# EAGLE design xboxeeprombeforearoute-2 (EAGLE 7.5.0)
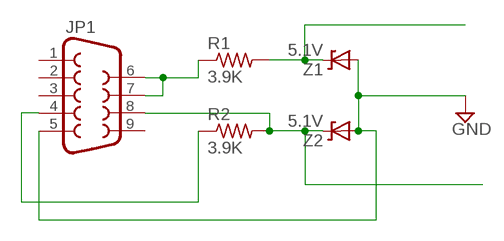
[diagram p0: schematic, sheet 1]

## Parts
JP1  DB9FEMALE  [DB9]
R1  3.9K  R-US_0207/9  [0207/9]
R2  3.9K  R-US_0207/9  [0207/9]
Z1  5.1V  DIODE-ZENERPTH  [DIODE-ZENER]
Z2  5.1V  DIODE-ZENERPTH  [DIODE-ZENER]

## Nets
GND: JP1.5 Z1.P$2(A) Z2.P$2(A)
N$1: JP1.6 JP1.7 R1.1
N$3: JP1.4 R2.1
SCL: R1.2 Z1.P$1(C)
SDA: JP1.8 R2.2 Z2.P$1(C)
Unconnected: JP1.1 JP1.2 JP1.3 JP1.9

## Library data of the parts
JP1 = SparkFun-Connectors:DB9: DB9 Connector Standard DB9 (D-Sub 9) serial connector. Can be used for CAN bus as well as RS485 and RS232. Footprint production proven. Spark Fun Electronics SKU : PRT-00429; OC_NEWARK: unknown; PROD_ID: CONN-08194
R1 R2 = adafruit:R-US_: RESISTOR, American symbol; OC_NEWARK: unknown
Z1 Z2 = Johnboiles:DIODE-ZENER: Zener Diode Production Part - 8199 3.4V Zener Voltage; OC_NEWARK: unknown

## Board
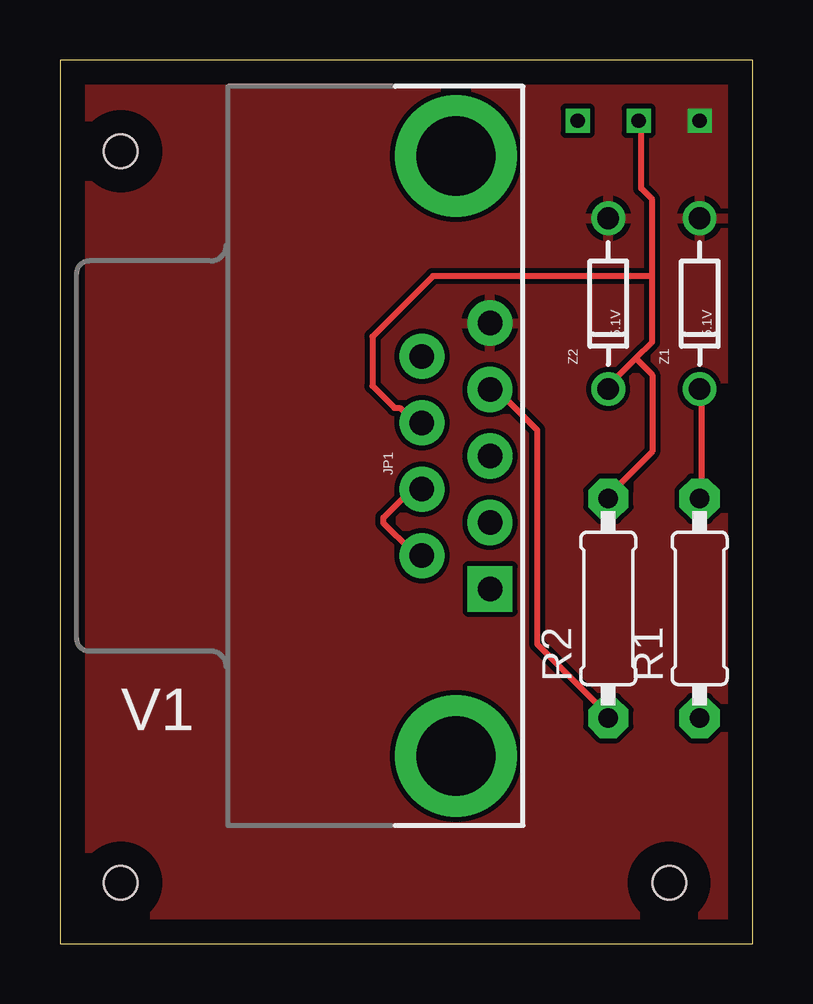
[diagram p1: board, top side]
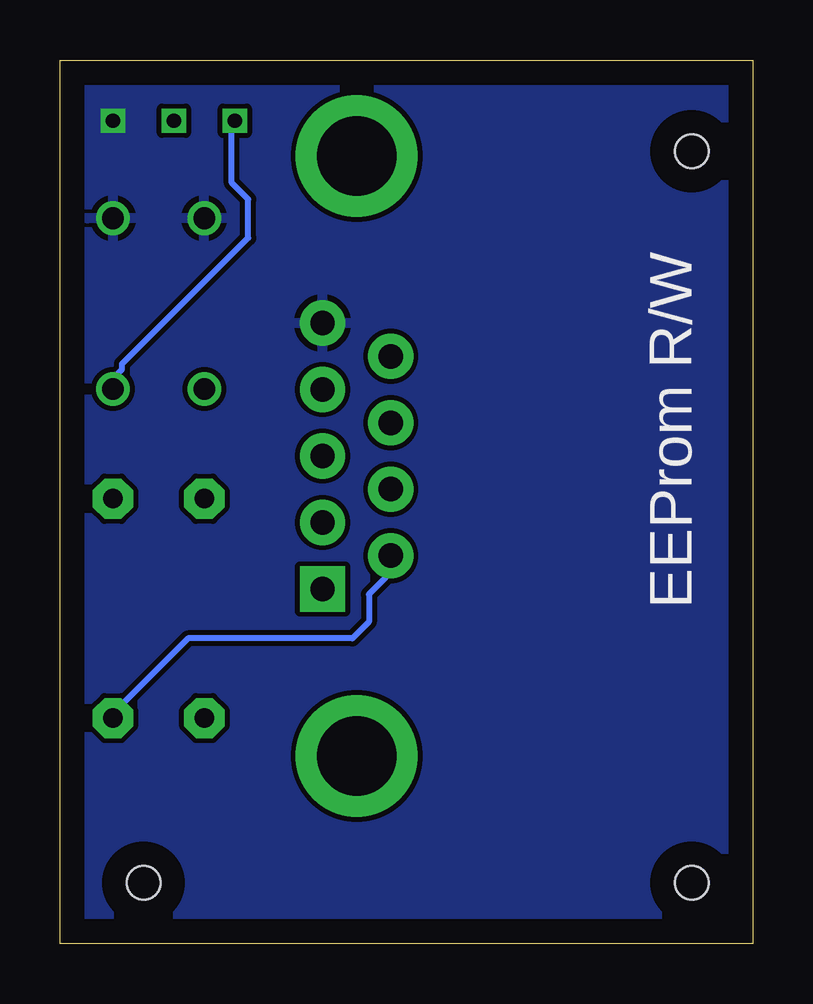
[diagram p2: board, bottom side, seen from below]

Size 28.88 x 36.82 mm. Coordinates in mm from the lower left corner, seen from the top.
Outline: 0,0 28.88,0 28.88,36.82 0,36.82 0,0
Copper layers (1*16): Top 0.035mm / dielectric 1.5mm / Bottom 0.035mm
Design rules "default": minimum track width 10mil, minimum drill 24mil, track to track 8mil, track to pad 8mil, pad to pad 8mil, via to via 8mil, smd to smd 8mil, copper to edge 40mil, drill to drill 8mil, minimum pad ring 10mil, minimum via ring 8mil, stop-mask expansion 4mil, vias tented up to drill 0mil, thermal gap 10mil
Holes 1.4 mm at 2.54,33.02 2.54,2.54 25.4,2.54

### Footprints (pad centres in the part's own frame; a part is rotated, then mirrored left to right if it is on the bottom)
DB9 = drill 1.016 pad 1.88 square: 1 -5.54,-1.42 | drill 1.016 pad 1.88: 2 -2.77,-1.42; 3 0,-1.42; 4 2.77,-1.42; 5 5.54,-1.42; 6 -4.15,1.42; 7 -1.38,1.42; 8 1.38,1.42; 9 4.15,1.42 | drill 3.302 pad 5.08: G1 -12.5,0; G2 12.5,0
0207/9 = drill 0.813 pad 1.676 octagon: 1 -4.572,0; 2 4.572,0
DIODE-ZENER = drill 0.9: P$1 -3.556,0; P$2 3.556,0

### Placement (x,y rotation side)
JP1  16.51,20.32 90 top
R1  26.67,13.97 90 top
R2  22.86,13.97 90 top
Z1  26.67,26.67 90 top
Z2  22.86,26.67 90 top

### Tracks (layer width: path | path; a pad name or v marks a point on that pad's centre or on a via)
GND  (via drill 0.6)
  other vias: 26.67,34.29
  pour Top: -1.27,38.1 -1.27,-2.54 30.48,-2.54 30.48,38.1
  pour Bottom: -1.27,38.1 -1.27,-1.27 31.75,-1.27 31.75,38.1
N$1
  Top 0.254: JP1.7 15.09,18.9 14.63,18.9 13.49,17.75 13.49,17.53 14.63,16.38 15.09,16.38 JP1.6
  Bottom 0.254: R1.1 26.52,9.52 26.52,9.75 23.55,12.72 16.69,12.72 16,13.41 16,14.55 15.32,15.24 15.32,16.15 JP1.6
N$3
  Top 0.254: R2.1 22.86,9.52 19.89,12.5 19.89,21.41 18.06,23.24 JP1.4
SCL  (via drill 0.6)
  Top 0.254: R1.2 26.75,18.67 26.75,23.01 Z1.P$1
  Bottom 0.254: v21.59,34.29 21.72,34.21 21.72,31.7 21.03,31.01 21.03,29.41 26.29,24.15 26.29,23.93 26.52,23.7 26.52,23.24 Z1.P$1
SDA  (via drill 0.6)
  Top 0.254: 24.69,27.81 24.69,25.07 24,24.38 | 24.69,27.81 24.69,31.01 24.23,31.47 24.23,34.21 v24.13,34.29 | 24,24.38 22.86,23.24 Z2.P$1 | 24,24.38 24.69,23.7 24.69,20.5 22.86,18.67 R2.2 | 24.69,27.81 15.54,27.81 13.03,25.3 13.03,23.24 13.95,22.33 14.17,22.33 14.63,21.87 15.09,21.87 JP1.8

### Text on the board
tNames: V1
bNames: EEProm R/W